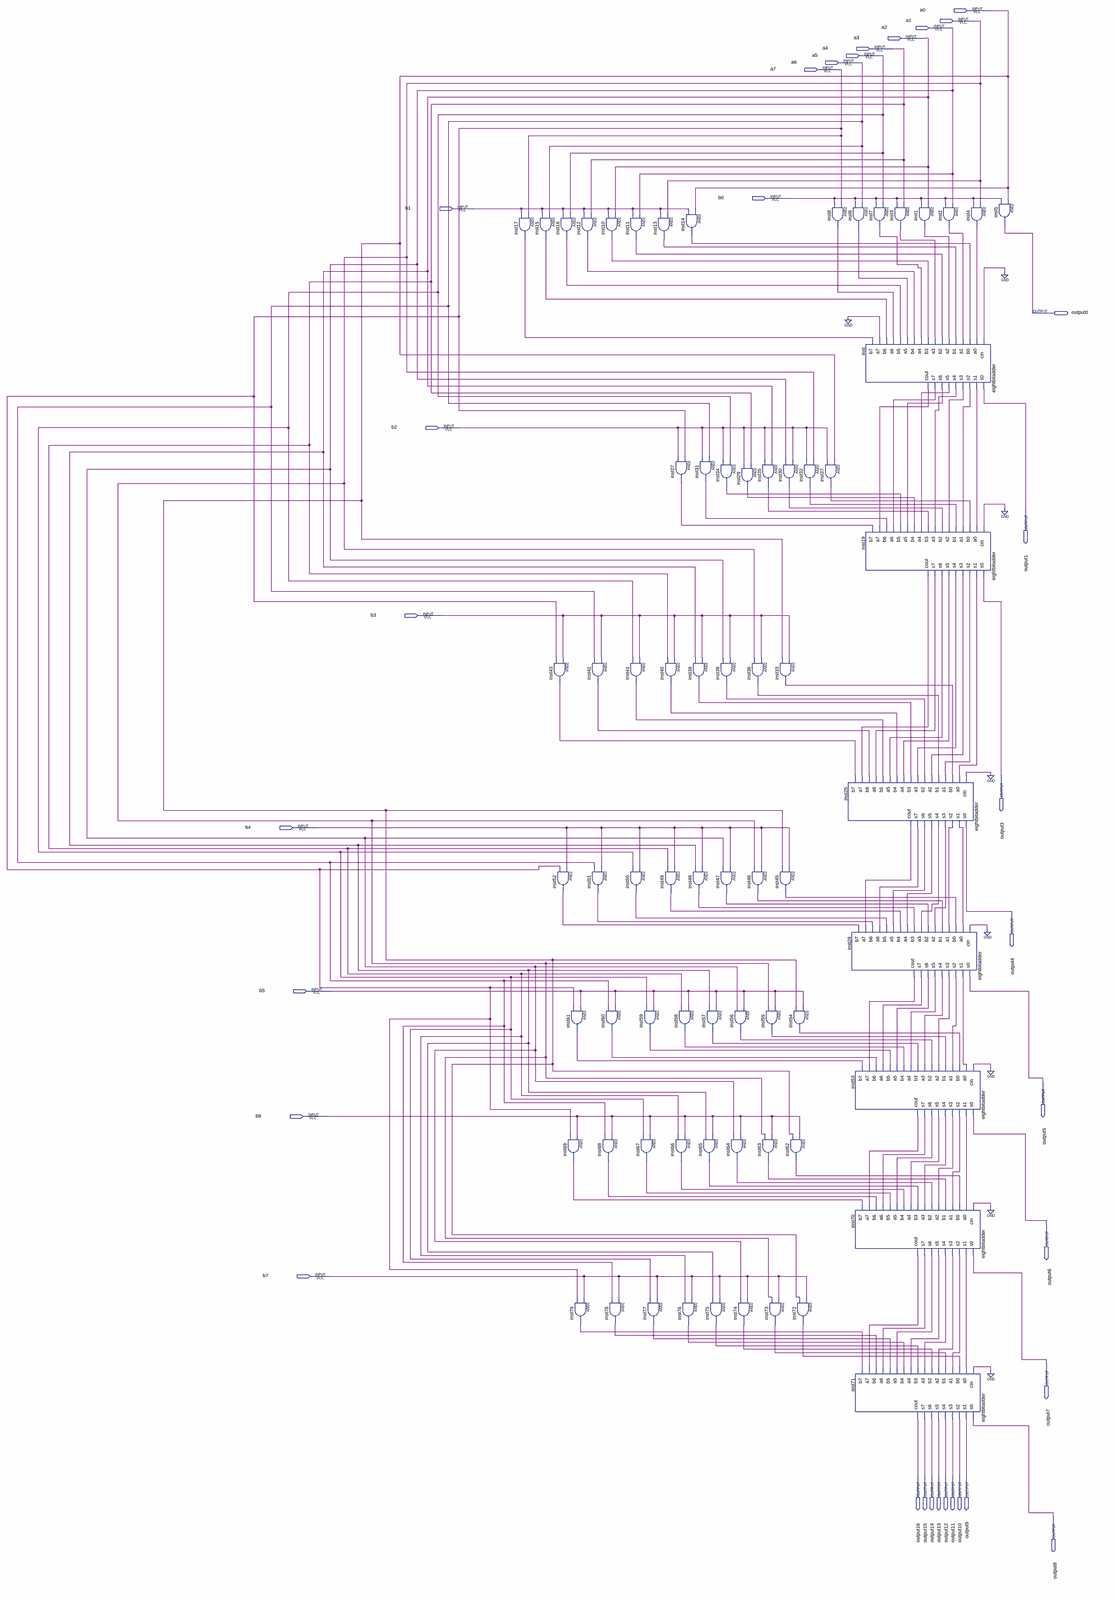
[diagram p0: schematic sheet, whole]
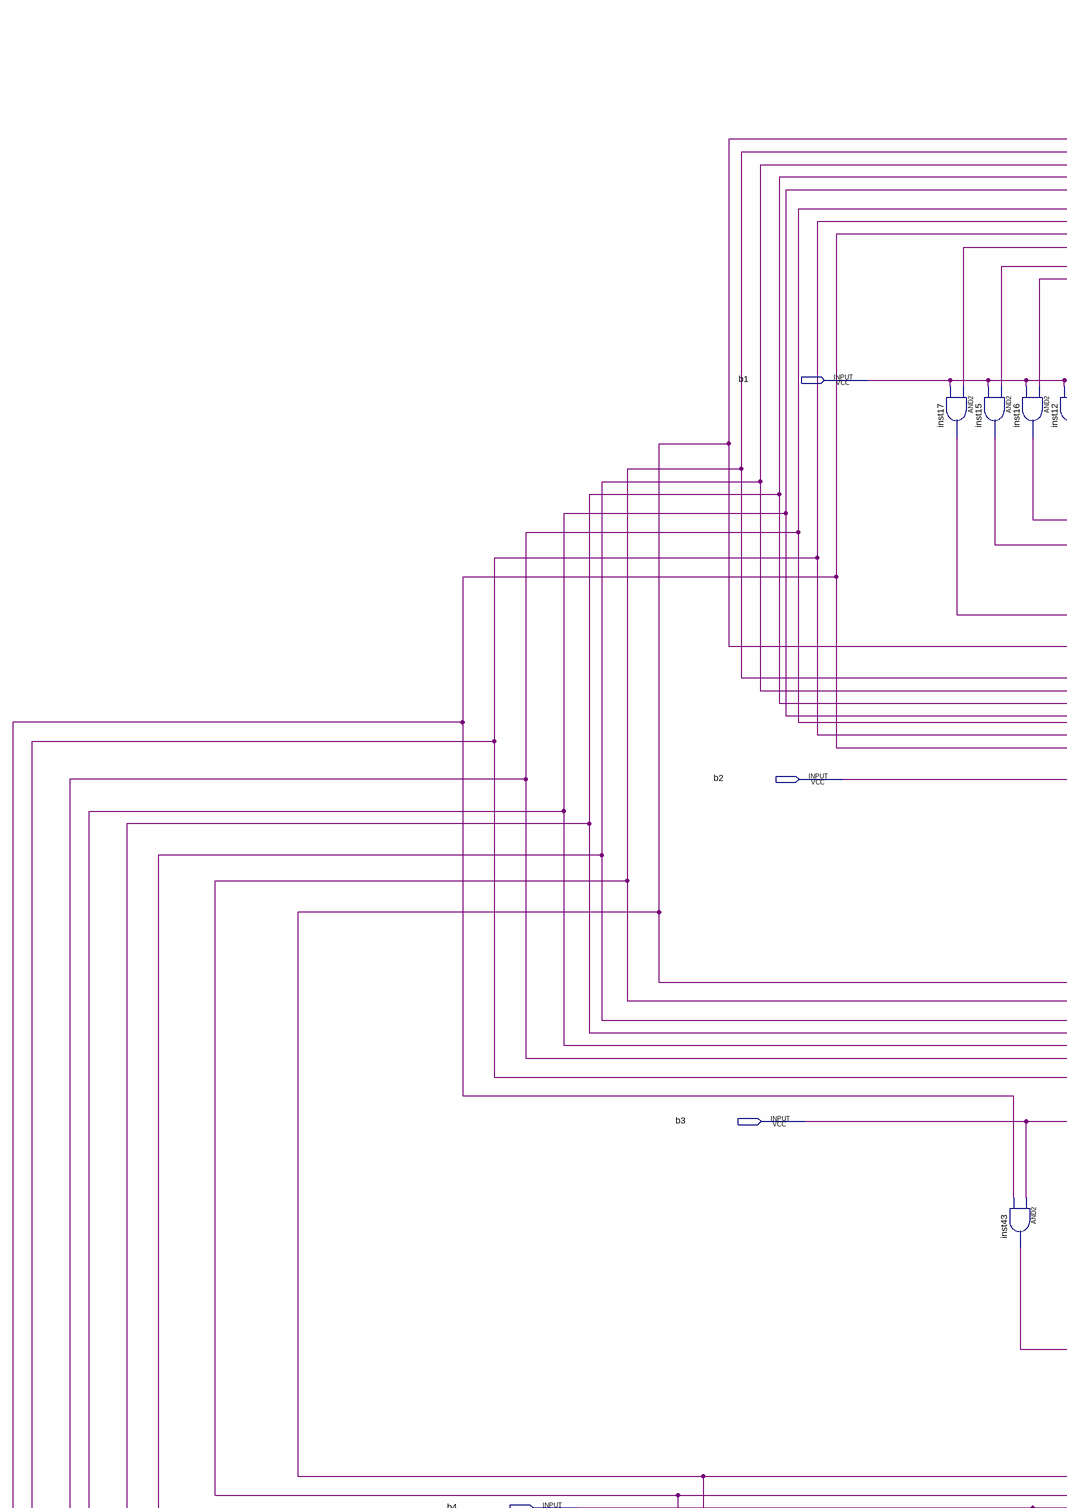
[diagram p1: schematic sheet, upper left part]
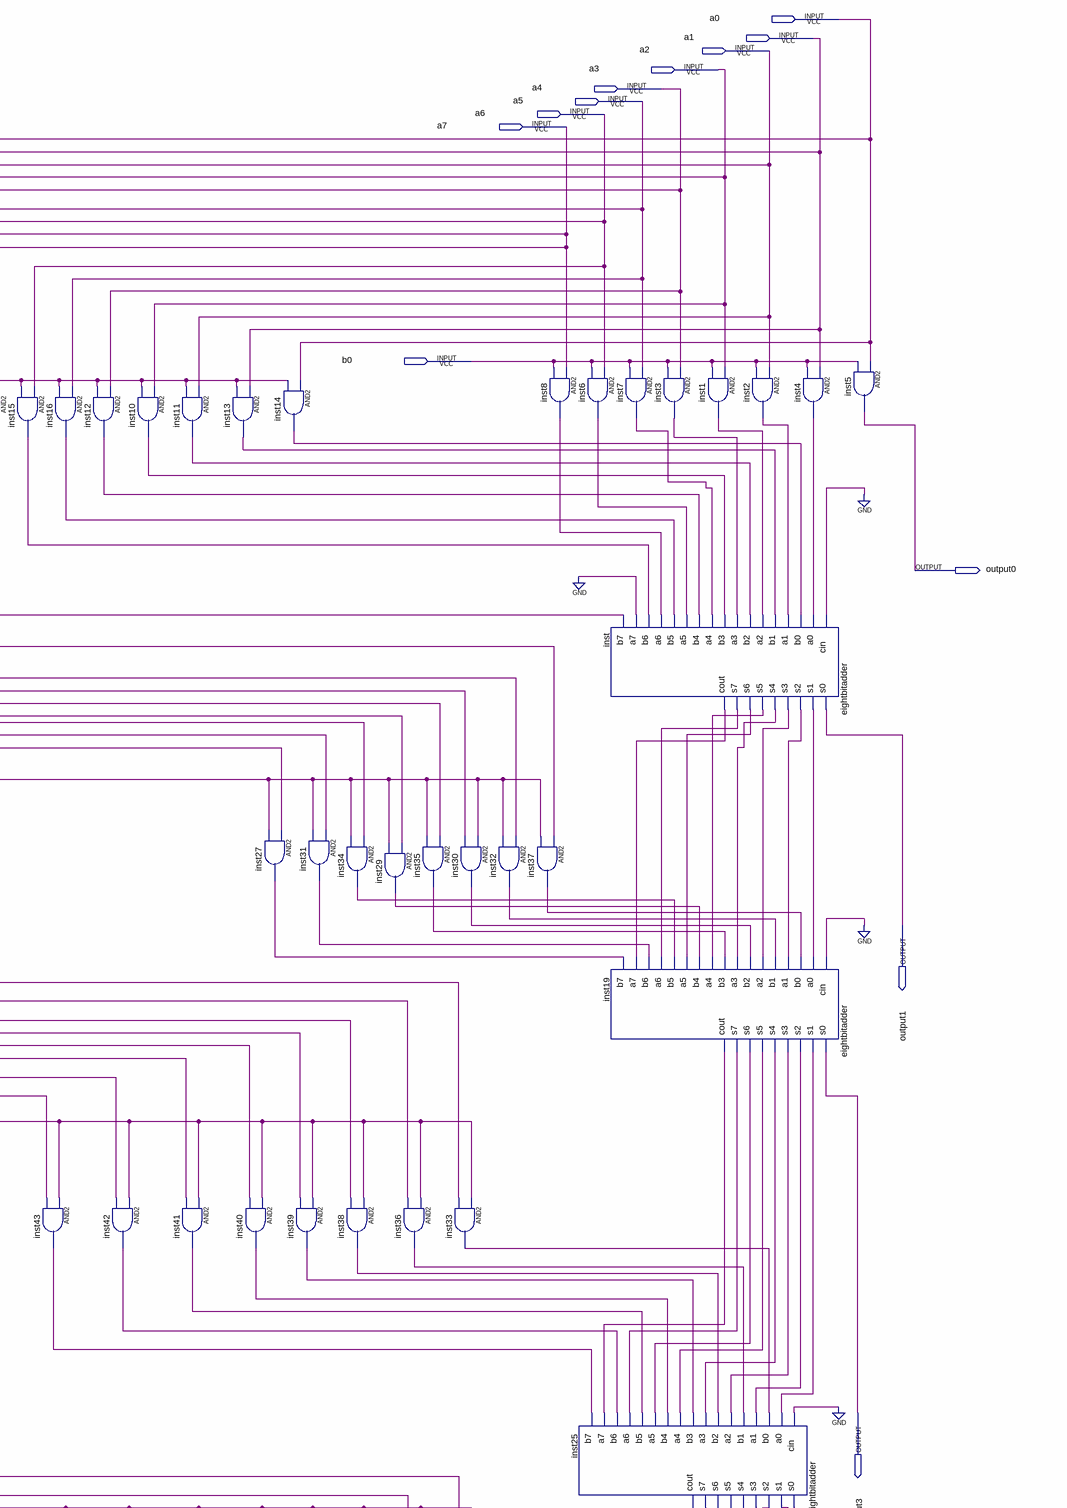
[diagram p2: schematic sheet, upper right part]
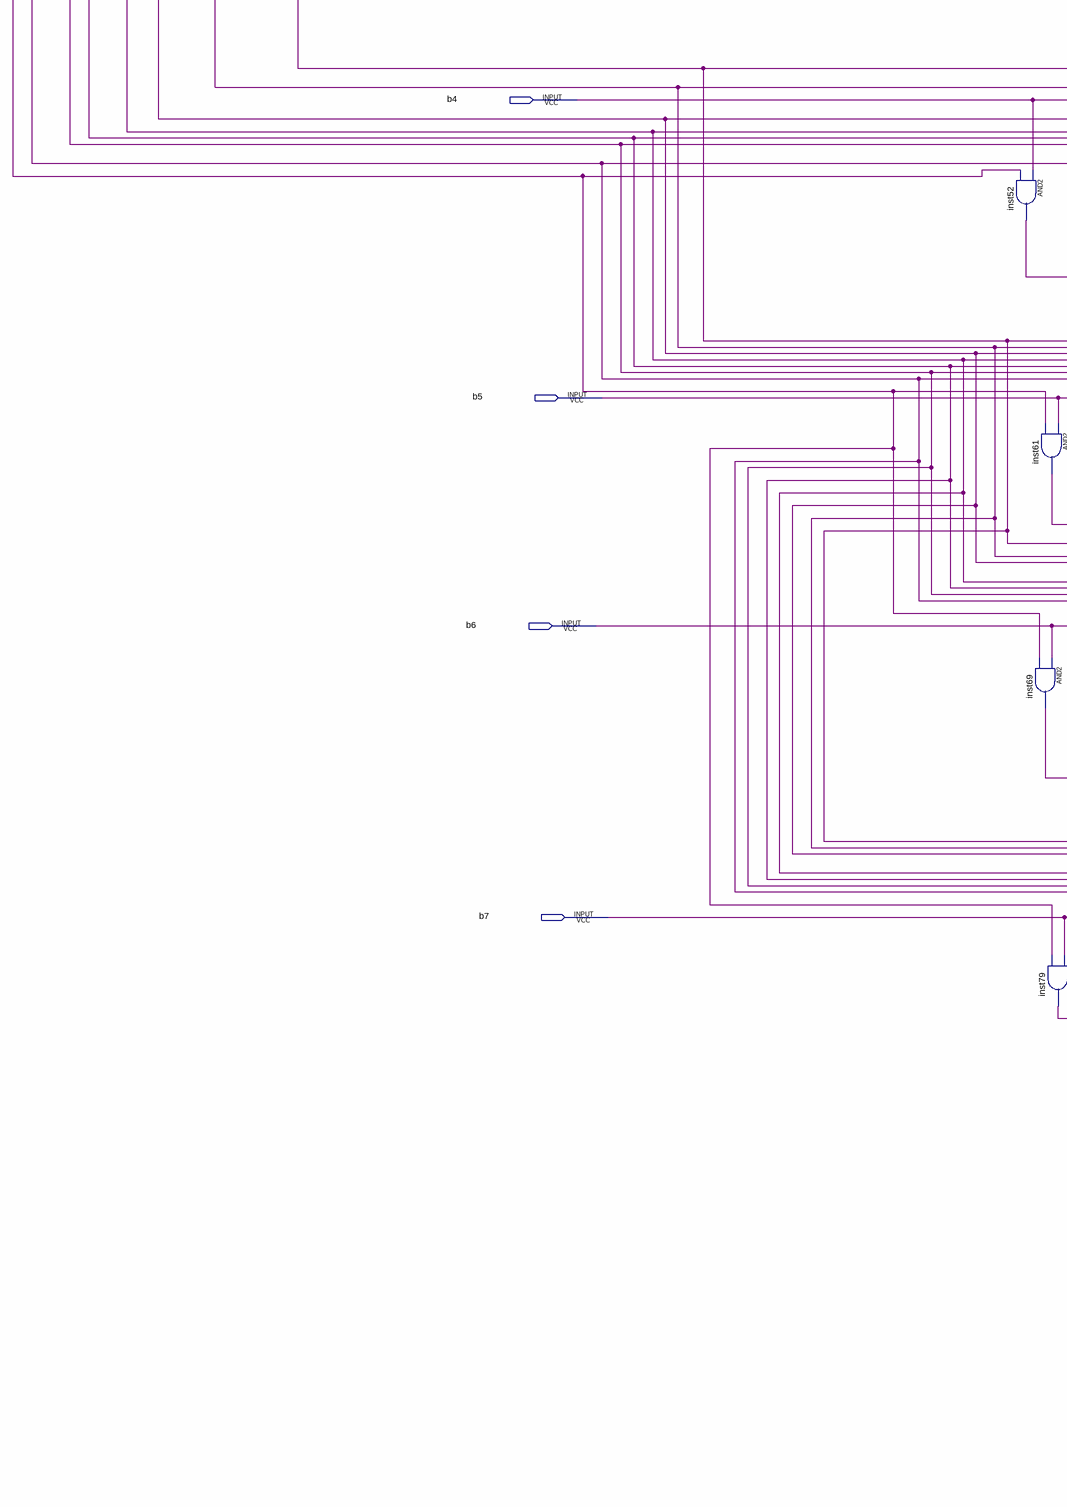
[diagram p3: schematic sheet, lower left part]
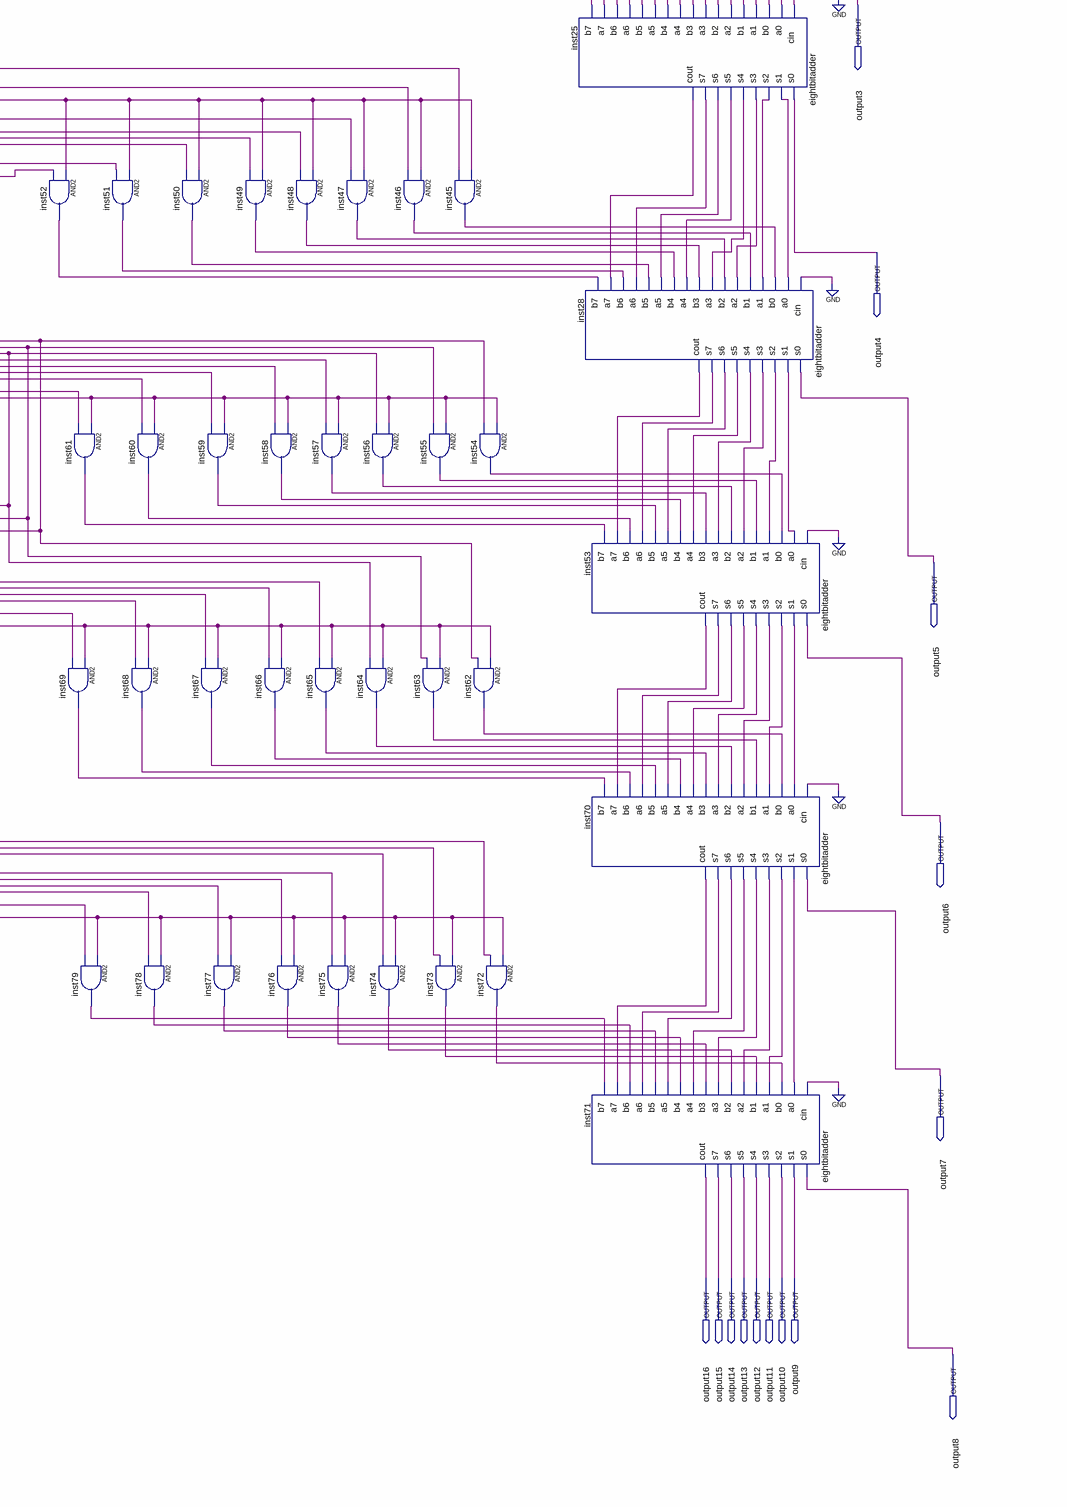
[diagram p4: schematic sheet, lower right part]
// Quartus schematic final.bdf as structural Verilog: 71 symbols, 32 pins
module \final  (
  input  a0,
  input  a1,
  input  a2,
  input  a3,
  input  a4,
  input  a5,
  input  a6,
  input  a7,
  input  b0,
  input  b1,
  input  b2,
  input  b3,
  input  b4,
  input  b5,
  input  b6,
  input  b7,
  output output0,
  output output1,
  output output3,
  output output4,
  output output5,
  output output6,
  output output7,
  output output16,
  output output15,
  output output14,
  output output13,
  output output12,
  output output11,
  output output10,
  output output9,
  output output8
);

  wire inst1_out, inst2_out, inst3_out, inst4_out, inst6_out, inst7_out, inst8_out, inst10_out, inst11_out,
       inst12_out, inst13_out, inst14_out, inst15_out, inst16_out, inst17_out, inst19_cout, inst19_s1,
       inst19_s2, inst19_s3, inst19_s4, inst19_s5, inst19_s6, inst19_s7, inst25_cout, inst25_s1, inst25_s2,
       inst25_s3, inst25_s4, inst25_s5, inst25_s6, inst25_s7, inst27_out, inst28_cout, inst28_s1, inst28_s2,
       inst28_s3, inst28_s4, inst28_s5, inst28_s6, inst28_s7, inst29_out, inst30_out, inst31_out, inst32_out,
       inst33_out, inst34_out, inst35_out, inst36_out, inst37_out, inst38_out, inst39_out, inst40_out,
       inst41_out, inst42_out, inst43_out, inst45_out, inst46_out, inst47_out, inst48_out, inst49_out,
       inst50_out, inst51_out, inst52_out, inst53_cout, inst53_s1, inst53_s2, inst53_s3, inst53_s4,
       inst53_s5, inst53_s6, inst53_s7, inst54_out, inst55_out, inst56_out, inst57_out, inst58_out,
       inst59_out, inst60_out, inst61_out, inst62_out, inst63_out, inst64_out, inst65_out, inst66_out,
       inst67_out, inst68_out, inst69_out, inst70_cout, inst70_s1, inst70_s2, inst70_s3, inst70_s4,
       inst70_s5, inst70_s6, inst70_s7, inst72_out, inst73_out, inst74_out, inst75_out, inst76_out,
       inst77_out, inst78_out, inst79_out, inst_cout, inst_s1, inst_s2, inst_s3, inst_s4, inst_s5, inst_s6,
       inst_s7;

  and inst17 (inst17_out, a7, b1);
  and inst15 (inst15_out, a6, b1);
  and inst16 (inst16_out, a5, b1);
  and inst43 (inst43_out, b3, a7);
  and inst52 (inst52_out, b4, a7);
  and inst12 (inst12_out, a4, b1);
  and inst61 (inst61_out, b5, a7);
  and inst69 (inst69_out, b6, a7);
  and inst79 (inst79_out, b7, a7);
  and inst10 (inst10_out, a3, b1);
  and inst42 (inst42_out, b3, a6);
  and inst51 (inst51_out, b4, a6);
  and inst60 (inst60_out, b5, a6);
  and inst68 (inst68_out, b6, a6);
  and inst78 (inst78_out, b7, a6);
  and inst11 (inst11_out, a2, b1);
  and inst41 (inst41_out, b3, a5);
  and inst50 (inst50_out, b4, a5);
  and inst59 (inst59_out, b5, a5);
  and inst67 (inst67_out, b6, a5);
  and inst13 (inst13_out, a1, b1);
  and inst40 (inst40_out, b3, a4);
  and inst49 (inst49_out, b4, a4);
  and inst77 (inst77_out, b7, a5);
  and inst14 (inst14_out, a0, b1);
  and inst31 (inst31_out, a6, b2);
  and inst27 (inst27_out, a7, b2);
  and inst39 (inst39_out, b3, a3);
  and inst48 (inst48_out, b4, a3);
  and inst58 (inst58_out, b5, a4);
  and inst66 (inst66_out, b6, a4);
  and inst76 (inst76_out, b7, a4);
  and inst34 (inst34_out, a5, b2);
  and inst38 (inst38_out, b3, a2);
  and inst47 (inst47_out, b4, a2);
  and inst57 (inst57_out, b5, a3);
  and inst65 (inst65_out, b6, a3);
  and inst75 (inst75_out, b7, a3);
  and inst29 (inst29_out, a4, b2);
  and inst36 (inst36_out, b3, a1);
  and inst46 (inst46_out, b4, a1);
  and inst56 (inst56_out, b5, a2);
  and inst64 (inst64_out, b6, a2);
  and inst74 (inst74_out, b7, a2);
  and inst30 (inst30_out, b2, a2);
  and inst35 (inst35_out, a3, b2);
  and inst33 (inst33_out, b3, a0);
  and inst45 (inst45_out, b4, a0);
  and inst55 (inst55_out, b5, a1);
  and inst63 (inst63_out, b6, a1);
  and inst73 (inst73_out, b7, a1);
  and inst32 (inst32_out, a1, b2);
  and inst54 (inst54_out, b5, a0);
  and inst62 (inst62_out, b6, a0);
  and inst72 (inst72_out, b7, a0);
  and inst8 (inst8_out, a7, b0);
  and inst37 (inst37_out, a0, b2);
  and inst6 (inst6_out, a6, b0);
  eightbitadder inst (
    .cin(1'b0), .a0(inst4_out), .b0(inst14_out), .a1(inst2_out), .b1(inst13_out), .a2(inst1_out),
    .b2(inst11_out), .a3(inst3_out), .b3(inst10_out), .a4(inst7_out), .b4(inst12_out), .a5(inst6_out),
    .b5(inst16_out), .a6(inst8_out), .b6(inst15_out), .a7(1'b0), .b7(inst17_out), .s0(output1), .s1(inst_s1),
    .s2(inst_s2), .s3(inst_s3), .s4(inst_s4), .s5(inst_s5), .s6(inst_s6), .s7(inst_s7), .cout(inst_cout));
  eightbitadder inst19 (
    .cin(1'b0), .a0(inst_s1), .b0(inst37_out), .a1(inst_s2), .b1(inst32_out), .a2(inst_s3), .b2(inst30_out),
    .a3(inst_s4), .b3(inst35_out), .a4(inst_s5), .b4(inst29_out), .a5(inst_s6), .b5(inst34_out),
    .a6(inst_s7), .b6(inst31_out), .a7(inst_cout), .b7(inst27_out), .s0(output3), .s1(inst19_s1),
    .s2(inst19_s2), .s3(inst19_s3), .s4(inst19_s4), .s5(inst19_s5), .s6(inst19_s6), .s7(inst19_s7),
    .cout(inst19_cout));
  eightbitadder inst25 (
    .cin(1'b0), .a0(inst19_s1), .b0(inst33_out), .a1(inst19_s2), .b1(inst36_out), .a2(inst19_s3),
    .b2(inst38_out), .a3(inst19_s4), .b3(inst39_out), .a4(inst19_s5), .b4(inst40_out), .a5(inst19_s6),
    .b5(inst41_out), .a6(inst19_s7), .b6(inst42_out), .a7(inst19_cout), .b7(inst43_out), .s0(output4),
    .s1(inst25_s1), .s2(inst25_s2), .s3(inst25_s3), .s4(inst25_s4), .s5(inst25_s5), .s6(inst25_s6),
    .s7(inst25_s7), .cout(inst25_cout));
  eightbitadder inst28 (
    .cin(1'b0), .a0(inst25_s1), .b0(inst45_out), .a1(inst25_s2), .b1(inst46_out), .a2(inst25_s3),
    .b2(inst47_out), .a3(inst25_s4), .b3(inst48_out), .a4(inst25_s5), .b4(inst49_out), .a5(inst25_s6),
    .b5(inst50_out), .a6(inst25_s7), .b6(inst51_out), .a7(inst25_cout), .b7(inst52_out), .s0(output5),
    .s1(inst28_s1), .s2(inst28_s2), .s3(inst28_s3), .s4(inst28_s4), .s5(inst28_s5), .s6(inst28_s6),
    .s7(inst28_s7), .cout(inst28_cout));
  eightbitadder inst53 (
    .cin(1'b0), .a0(inst28_s1), .b0(inst54_out), .a1(inst28_s2), .b1(inst55_out), .a2(inst28_s3),
    .b2(inst56_out), .a3(inst28_s4), .b3(inst57_out), .a4(inst28_s5), .b4(inst58_out), .a5(inst28_s6),
    .b5(inst59_out), .a6(inst28_s7), .b6(inst60_out), .a7(inst28_cout), .b7(inst61_out), .s0(output6),
    .s1(inst53_s1), .s2(inst53_s2), .s3(inst53_s3), .s4(inst53_s4), .s5(inst53_s5), .s6(inst53_s6),
    .s7(inst53_s7), .cout(inst53_cout));
  eightbitadder inst70 (
    .cin(1'b0), .a0(inst53_s1), .b0(inst62_out), .a1(inst53_s2), .b1(inst63_out), .a2(inst53_s3),
    .b2(inst64_out), .a3(inst53_s4), .b3(inst65_out), .a4(inst53_s5), .b4(inst66_out), .a5(inst53_s6),
    .b5(inst67_out), .a6(inst53_s7), .b6(inst68_out), .a7(inst53_cout), .b7(inst69_out), .s0(output7),
    .s1(inst70_s1), .s2(inst70_s2), .s3(inst70_s3), .s4(inst70_s4), .s5(inst70_s5), .s6(inst70_s6),
    .s7(inst70_s7), .cout(inst70_cout));
  eightbitadder inst71 (
    .cin(1'b0), .a0(inst70_s1), .b0(inst72_out), .a1(inst70_s2), .b1(inst73_out), .a2(inst70_s3),
    .b2(inst74_out), .a3(inst70_s4), .b3(inst75_out), .a4(inst70_s5), .b4(inst76_out), .a5(inst70_s6),
    .b5(inst77_out), .a6(inst70_s7), .b6(inst78_out), .a7(inst70_cout), .b7(inst79_out), .s0(output8),
    .s1(output9), .s2(output10), .s3(output11), .s4(output12), .s5(output13), .s6(output14), .s7(output15),
    .cout(output16));
  and inst3 (inst3_out, a4, b0);
  and inst7 (inst7_out, a5, b0);
  and inst1 (inst1_out, a3, b0);
  and inst2 (inst2_out, a2, b0);
  and inst4 (inst4_out, a1, b0);
  and inst5 (output0, a0, b0);
endmodule
